# Altium project esp32_s3_beta.PrjPcb
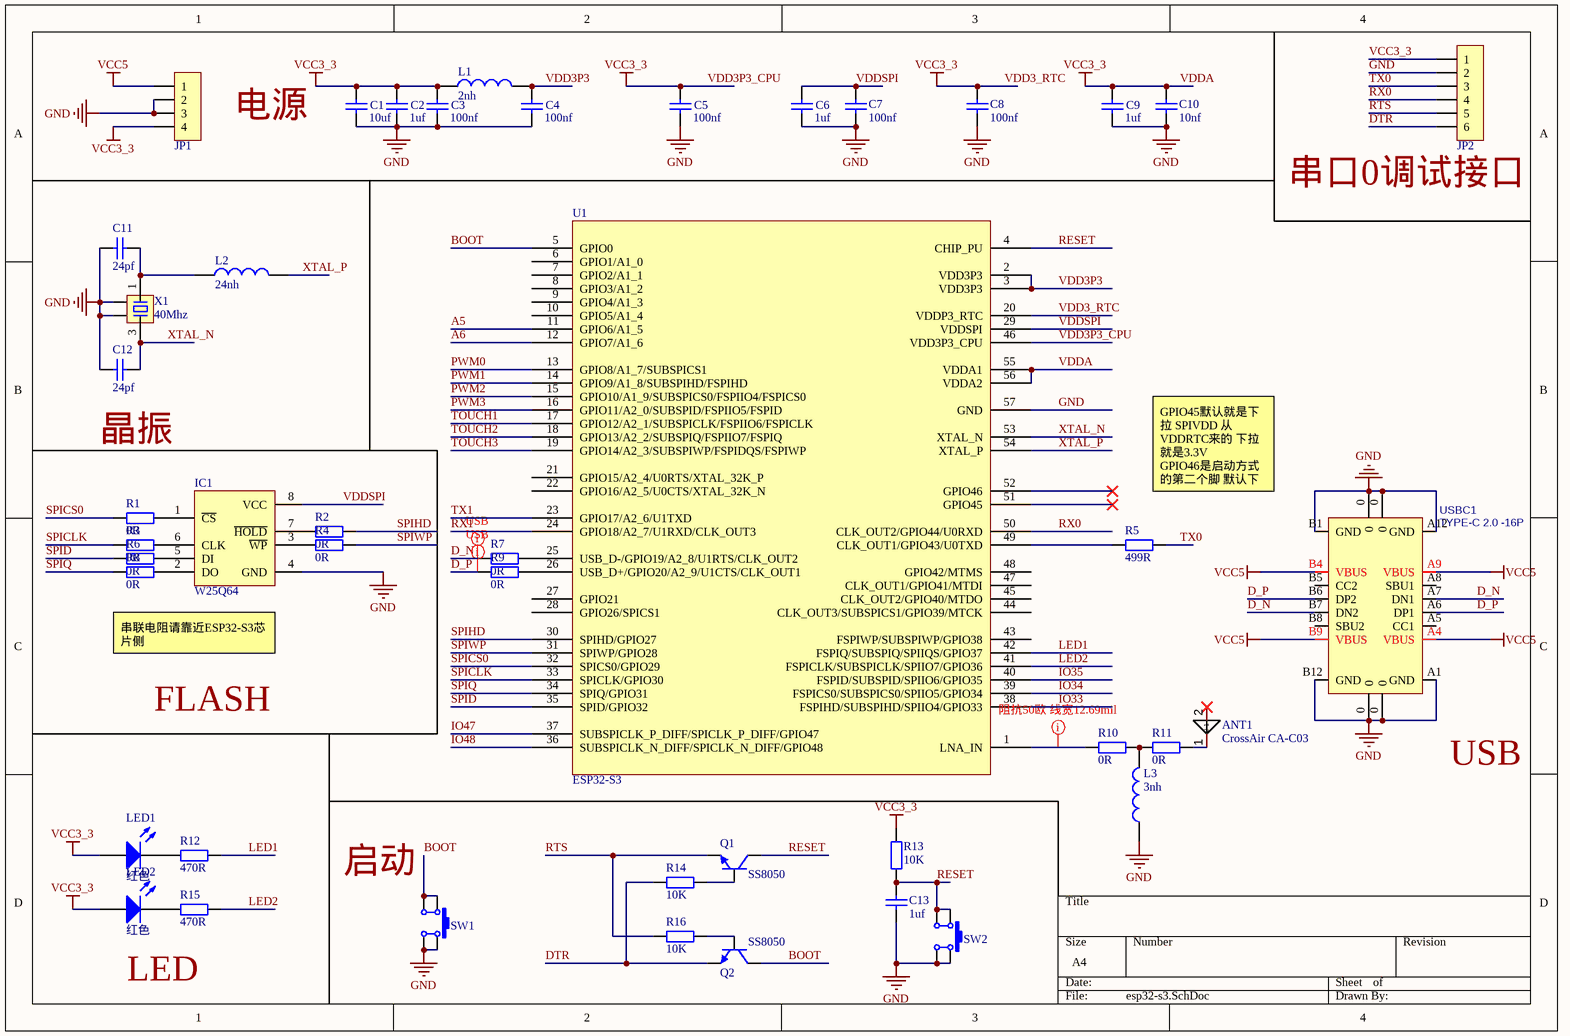
[diagram p0: esp32-s3.SchDoc]
2 sheets, 54 parts. Net scope: global (net labels, ports and power ports of the same name join across sheets).
Board file: esp32-s3_poly.PcbDoc
Sheets:
  esp32-s3.SchDoc
  connector.SchDoc

## Sheet esp32-s3.SchDoc
size A4; SheetNumber: 1; SheetTotal: 2

### Parts
ANT1  CrossAir CA-C03  [crossair ca-co3]
C1  10uf  [C0603_L]
C2  1uf  [C0603_L]
C3  100nf  [C0402_L]
C4  100nf  [C0402_L]
C5  100nf  [C0603_L]
C6  1uf  [C0603_L]
C7  100nf  [C0603_L]
C8  100nf  [C0603_L]
C9  1uf  [C0603_L]
C10  10nf  [C0603_L]
C11  24pf  [C0603_L]
C12  24pf  [C0603_L]
C13  1uf  [C0603_L]
IC1  W25Q64  [SOP8W_L]
JP1  HDR-1X4  [HDR2.54-LI-4P]  (value not drawn)
JP2  HDR-1X6  [HDR2.54-LI-6P]  (value not drawn)
L1  2nh  [L0402]
L2  24nh  [L0402]
L3  3nh  [L0402]
LED1  红色  [LED0603_R]
LED2  红色  [LED0603_R]
Q1  SS8050  [SOT23-3N]
Q2  SS8050  [SOT23-3N]
R1  0R  [R0402_L]
R2  0R  [R0402_L]
R3  0R  [R0402_L]
R4  0R  [R0402_L]
R5  499R  [R0603_L]
R6  0R  [R0402_L]
R7  0R  [R0402_L]
R8  0R  [R0402_L]
R9  0R  [R0402_L]
R10  0R  [R0402_L]
R11  0R  [R0402_L]
R12  470R  [R0603_L]
R13  10K  [R0603_L]
R14  10K  [R0603_L]
R15  470R  [R0603_L]
R16  10K  [R0603_L]
SW1  3*4*2.5  [SW-SMD-4.2x3.2_4P]  (value not drawn)
SW2  3*4*2.5  [SW-SMD-4.2x3.2_4P]  (value not drawn)
U1  ESP32-S3  [QFN56 7x7]
USBC1  TYPE-C 2.0 -16P  [USB-C-SMD_16P]
X1  40Mhz  [XTAL-3225-4P]

### Nets
GND: C1.1 C2.1 C3.1 C4.1 C5.1 C6.1 C7.1 C8.1 C9.1 C10.1 C11.1 C12.1 C13.1 IC1.4(GND) JP1.2 JP1.3 JP2.2 L3.1 SW1.2 SW1.3 SW2.2 SW2.3 U1.57(GND) USBC1.0 USBC1.A1(GND) USBC1.A12(GND) USBC1.B1(GND) USBC1.B12(GND) X1.2 X1.4
VCC3_3: C1.2 C2.2 C3.2 C5.2 C8.2 C9.2 C10.2 JP1.4 JP2.1 L1.1 LED1.1(A) LED2.1(A) R13.1 U1.20(VDDP3_RTC) U1.46(VDD3P3_CPU) U1.55(VDDA1) U1.56(VDDA2)  [also labelled VDD3_RTC, VDD3P3_CPU, VDDA]
VCC5: JP1.1 USBC1.A4(VBUS) USBC1.A9(VBUS) USBC1.B4(VBUS) USBC1.B9(VBUS)
A5: U1.11(GPIO6/A1_5)
A6: U1.12(GPIO7/A1_6)
BOOT: Q2.3(C) SW1.1 SW1.4 U1.5(GPIO0)
D_N: R7.1 USBC1.A7(DN1) USBC1.B7(DN2)
D_P: R9.1 USBC1.A6(DP1) USBC1.B6(DP2)
DTR: JP2.6 Q2.2(E) R14.2
IO33: U1.38(FSPIHD/SUBSPIHD/SPIIO4/GPIO33)
IO34: U1.39(FSPICS0/SUBSPICS0/SPIIO5/GPIO34)
IO35: U1.40(FSPID/SUBSPID/SPIIO6/GPIO35)
IO47: U1.37(SUBSPICLK_P_DIFF/SPICLK_P_DIFF/GPIO47)
IO48: U1.36(SUBSPICLK_N_DIFF/SPICLK_N_DIFF/GPIO48)
LED1: R12.1 U1.42(FSPIQ/SUBSPIQ/SPIIQS/GPIO37)
LED2: R15.1 U1.41(FSPICLK/SUBSPICLK/SPIIO7/GPIO36)
PWM0: U1.13(GPIO8/A1_7/SUBSPICS1)
PWM1: U1.14(GPIO9/A1_8/SUBSPIHD/FSPIHD)
PWM2: U1.15(GPIO10/A1_9/SUBSPICS0/FSPIIO4/FSPICS0)
PWM3: U1.16(GPIO11/A2_0/SUBSPID/FSPIIO5/FSPID)
RESET: C13.2 Q1.3(C) R13.2 SW2.1 SW2.4 U1.4(CHIP_PU)
RTS: JP2.5 Q1.2(E) R16.2
RX0: JP2.4 U1.50(CLK_OUT2/GPIO44/U0RXD)
RX1: U1.24(GPIO18/A2_7/U1RXD/CLK_OUT3)
SPICLK: R3.1 U1.33(SPICLK/GPIO30)
SPICS0: R1.1 U1.32(SPICS0/GPIO29)
SPID: R6.1 U1.35(SPID/GPIO32)
SPIHD: R2.2 U1.30(SPIHD/GPIO27)
SPIQ: R8.1 U1.34(SPIQ/GPIO31)
SPIWP: R4.2 U1.31(SPIWP/GPIO28)
TOUCH1: U1.17(GPIO12/A2_1/SUBSPICLK/FSPIIO6/FSPICLK)
TOUCH2: U1.18(GPIO13/A2_2/SUBSPIQ/FSPIIO7/FSPIQ)
TOUCH3: U1.19(GPIO14/A2_3/SUBSPIWP/FSPIDQS/FSPIWP)
TX0: JP2.3 R5.1
TX1: U1.23(GPIO17/A2_6/U1TXD)
VDD3P3: C4.2 L1.2 U1.2(VDD3P3) U1.3(VDD3P3)
VDDSPI: C6.2 C7.2 IC1.8(VCC) U1.29(VDDSPI)
XTAL_N: C12.2 U1.53(XTAL_N) X1.3
XTAL_P: L2.2 U1.54(XTAL_P)
NetANT1_1: ANT1.1 R11.2
NetC11_2: C11.2 L2.1 X1.1
NetIC1_1: IC1.1(~{CS}) R1.2
NetIC1_2: IC1.2(DO) R8.2
NetIC1_3: IC1.3(~{WP}) R4.1
NetIC1_5: IC1.5(DI) R6.2
NetIC1_6: IC1.6(CLK) R3.2
NetIC1_7: IC1.7(~{HOLD}) R2.1
NetL3_2: L3.2 R10.2 R11.1
NetLED1_2: LED1.2(K) R12.2
NetLED2_2: LED2.2(K) R15.2
NetQ1_1: Q1.1(B) R14.1
NetQ2_1: Q2.1(B) R16.1
NetR5_2: R5.2 U1.49(CLK_OUT1/GPIO43/U0TXD)
NetR7_2: R7.2 U1.25(USB_D-/GPIO19/A2_8/U1RTS/CLK_OUT2)
NetR9_2: R9.2 U1.26(USB_D+/GPIO20/A2_9/U1CTS/CLK_OUT1)
NetR10_1: R10.1 U1.1(LNA_IN)

Not connected (* = marked no-connect by the designer): ANT1 2*; U1 6(GPIO1/A1_0) 7(GPIO2/A1_1) 8(GPIO3/A1_2) 9(GPIO4/A1_3) 10(GPIO5/A1_4) 21(GPIO15/A2_4/U0RTS/XTAL_32K_P) 22(GPIO16/A2_5/U0CTS/XTAL_32K_N) 27(GPIO21) 28(GPIO26/SPICS1) 43(FSPIWP/SUBSPIWP/GPIO38) 44(CLK_OUT3/SUBSPICS1/GPIO39/MTCK) 45(CLK_OUT2/GPIO40/MTDO) 47(CLK_OUT1/GPIO41/MTDI) 48(GPIO42/MTMS) 51(GPIO45)* 52(GPIO46)*; USBC1 A5(CC1) A8(SBU1) B5(CC2) B8(SBU2)

### Layout directives
mark named 阻抗50欧 线宽12.69mil: NetR10_1
differential pair: D_N, D_P

### Notes on the sheet
- 电源
- (near JP2) 串口0调试接口
- (near C12) 晶振
- GPIO45默认就是下拉 SPIVDD 从VDDRTC来的 下拉就是3.3V
  GPIO46是启动方式的第二个脚 默认下拉
- 串联电阻请靠近ESP32-S3芯片侧
- FLASH
- (near USBC1) USB
- (near SW1) 启动
- LED

### Library data of the parts
ANT1 = CrossAir CA-C03: 2450±50MHz 4.3DBi 50欧 功率3W; Add into BOM: yes; Symbol: CrossAir CA-C03; Device: CrossAir CA-C03; Convert to PCB: yes; Value: CrossAir CA-C03; Name: CrossAir CA-C03
C1-C10 C13 = C: 贴片电容/MLCC电容; BOM名称: 无极性贴片电容; 联系下单店铺卖家 免费帮你查找封装: 联系下单店铺卖家 免费技术指导
C11 C12 = C: 贴片电容/MLCC电容 C1654; BOM名称: 无极性贴片电容; 联系下单店铺卖家 免费帮你查找封装: 联系下单店铺卖家 免费技术指导
IC1 = W25Q: SPI Flash C83140; BOM名称: 外置Flash; 封装库来自淘宝卖家：黄晶宝石: 其他店铺购入均为盗版封装库，无更新权益，请立即申请退款，联系卖家：黄晶宝石 获取现金奖励200~5000元
JP1 = Header 4: 4P接插件; 联系卖家，免费查找封装: 唯一出售店铺网址https://shop463601444.taobao.com; 封装库来自淘宝卖家ID：黄晶宝石: 其他店铺购入均为盗版封装库，请立即申请退款，本店现金奖励50~200元; BOM名称: 4P接插件
JP2 = Header 6: 6P接插件; 联系卖家，免费查找封装: 唯一出售店铺网址https://shop463601444.taobao.com; 封装库来自淘宝卖家ID：黄晶宝石: 其他店铺购入均为盗版封装库，请立即申请退款，本店现金奖励50~200元; BOM名称: 6P接插件
L1 = L: 贴片小功率电感 C18216; BOM名称: 小功率贴片电感; 联系下单店铺卖家 免费帮你查找封装: 联系下单店铺卖家 免费技术指导
L2 = L: 贴片小功率电感 C74301; BOM名称: 小功率贴片电感; 联系下单店铺卖家 免费帮你查找封装: 联系下单店铺卖家 免费技术指导
L3 = L: 贴片小功率电感; BOM名称: 小功率贴片电感; 联系下单店铺卖家 免费帮你查找封装: 联系下单店铺卖家 免费技术指导
LED1 LED2 = LED: 贴片LED; 封装库来自淘宝卖家：黄晶宝石: 其他店铺购入均为盗版封装库，无更新权益，请立即申请退款，本店现金奖励200~1000元; BOM名称: 贴片LED
Q1 Q2 = 8050-SMD: 高频放大-NPN型; 属性: 40V 1.5A 1W 100MHZ; 卖家免费技术支持，联系售后: 唯一出售店铺网址https://shop463601444.taobao.com; 封装库来自淘宝卖家 ID：黄晶宝石: 其他店铺购入均为假冒，请立即申请退款，本店奖励2~5元现金; BOM名称: 高频放大-NPN型; 卖家免费查找封装，联系售后: 唯一出售店铺网址https://shop463601444.taobao.com
R1-R16 = R: 贴片电阻; 联系下单店铺卖家 免费帮你查找封装: 联系下单店铺卖家 免费技术指导; BOM名称: 贴片电阻
SW1 SW2 = SW SMD-3*4*2.5: 贴片4脚轻触开关 C2690012; 联系下单店铺卖家 免费技术支持: 联系下单店铺卖家 免费帮你查找封装
U1 = ESP32-S3: 2.4 GHz Wi­Fi + 低功耗蓝牙 SoC
USBC1 = USB2.0_Type-C_16Pin: USB2.0_Type-C_16Pin母座; 当前库版本V2024.2.3 @淘宝卖家:黄晶宝石: 最新版本发布https://item.taobao.com/item.htm?id=566775463719
X1 = XTAL-4P: 4脚无源晶振(谐振器）C5203551; 联系下单店铺卖家 免费帮你查找封装: 联系下单店铺卖家 免费技术指导; BOM名称: 4脚无源晶振(谐振器）

## Sheet connector.SchDoc
size A4; SheetNumber: 2; SheetTotal: 2
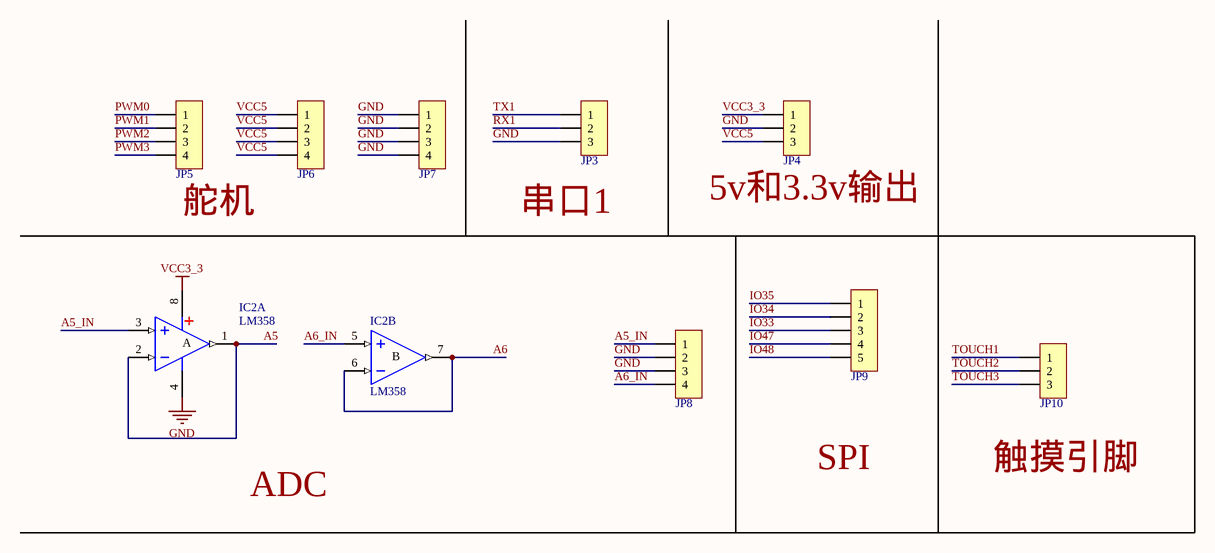
[diagram p1: connector.SchDoc]

### Parts
IC2  LM358  [SOP8_N]  (parts A,B of 2)
JP3  HDR-1X3  [HDR2.54-LI-3P]  (value not drawn)
JP4  HDR-1X3  [HDR2.54-LI-3P]  (value not drawn)
JP5  HDR-1X4  [HDR2.54-LI-4P]  (value not drawn)
JP6  HDR-1X4  [HDR2.54-LI-4P]  (value not drawn)
JP7  HDR-1X4  [HDR2.54-LI-4P]  (value not drawn)
JP8  HDR-1X4  [HDR2.54-LI-4P]  (value not drawn)
JP9  HDR-1X5  [HDR2.54-LI-5P]  (value not drawn)
JP10  HDR-1X3  [HDR2.54-LI-3P]  (value not drawn)

### Nets
GND: IC2.4(V-) JP3.3 JP4.2 JP7.1 JP7.2 JP7.3 JP7.4 JP8.2 JP8.3
VCC3_3: IC2.8(V+) JP4.1
VCC5: JP4.3 JP6.1 JP6.2 JP6.3 JP6.4
A5: IC2.1(OUT) IC2.2(IN-)
A5_IN: IC2.3(IN+) JP8.1
A6: IC2.6(IN-) IC2.7(OUT)
A6_IN: IC2.5(IN+) JP8.4
IO33: JP9.3
IO34: JP9.2
IO35: JP9.1
IO47: JP9.4
IO48: JP9.5
PWM0: JP5.1
PWM1: JP5.2
PWM2: JP5.3
PWM3: JP5.4
RX1: JP3.2
TOUCH1: JP10.1
TOUCH2: JP10.2
TOUCH3: JP10.3
TX1: JP3.1

### Notes on the sheet
- (near JP5) 舵机
- (near JP3) 串口1
- (near JP4) 5v和3.3v输出
- ADC
- SPI
- 触摸引脚
- (in symbol LM358, part A) A
- (in symbol LM358, part B) B

### Library data of the parts
IC2 = LM358: 双路运放; 封装库来自淘宝卖家：黄晶宝石: 其他店铺购入均为赃物，无售后更新权益，请立即申请退款，退款后现金奖励200~1000元; BOM名称: 双路运放
JP3 JP4 JP10 = Header 3: 3P接插件; 联系卖家，免费查找封装: 唯一出售店铺网址https://shop463601444.taobao.com; 封装库来自淘宝卖家ID：黄晶宝石: 其他店铺购入均为盗版封装库，请立即申请退款，本店现金奖励50~200元; BOM名称: 3P接插件
JP5-JP8 = Header 4: as JP1 on sheet esp32-s3; BOM名称: 4P接插件
JP9 = Header 5: 5P接插件; 联系卖家，免费查找封装: 唯一出售店铺网址https://shop463601444.taobao.com; 封装库来自淘宝卖家ID：黄晶宝石: 其他店铺购入均为盗版封装库，请立即申请退款，本店现金奖励50~200元; BOM名称: 5P接插件

## Nets that join several sheets
GND: esp32-s3 (30 pins), connector (9 pins)
VCC3_3: esp32-s3 (17 pins), connector (IC2.8 JP4.1)
VCC5: esp32-s3 (5 pins), connector (5 pins)
A5: esp32-s3 (U1.11), connector (IC2.1 IC2.2)
A6: esp32-s3 (U1.12), connector (IC2.6 IC2.7)
IO33: esp32-s3 (U1.38), connector (JP9.3)
IO34: esp32-s3 (U1.39), connector (JP9.2)
IO35: esp32-s3 (U1.40), connector (JP9.1)
IO47: esp32-s3 (U1.37), connector (JP9.4)
IO48: esp32-s3 (U1.36), connector (JP9.5)
PWM0: esp32-s3 (U1.13), connector (JP5.1)
PWM1: esp32-s3 (U1.14), connector (JP5.2)
PWM2: esp32-s3 (U1.15), connector (JP5.3)
PWM3: esp32-s3 (U1.16), connector (JP5.4)
RX1: esp32-s3 (U1.24), connector (JP3.2)
TOUCH1: esp32-s3 (U1.17), connector (JP10.1)
TOUCH2: esp32-s3 (U1.18), connector (JP10.2)
TOUCH3: esp32-s3 (U1.19), connector (JP10.3)
TX1: esp32-s3 (U1.23), connector (JP3.1)